# Altium schematic sheet MOTOR_CONTROL-1.SchDoc
size A; SheetNumber: 11; SheetTotal: 12
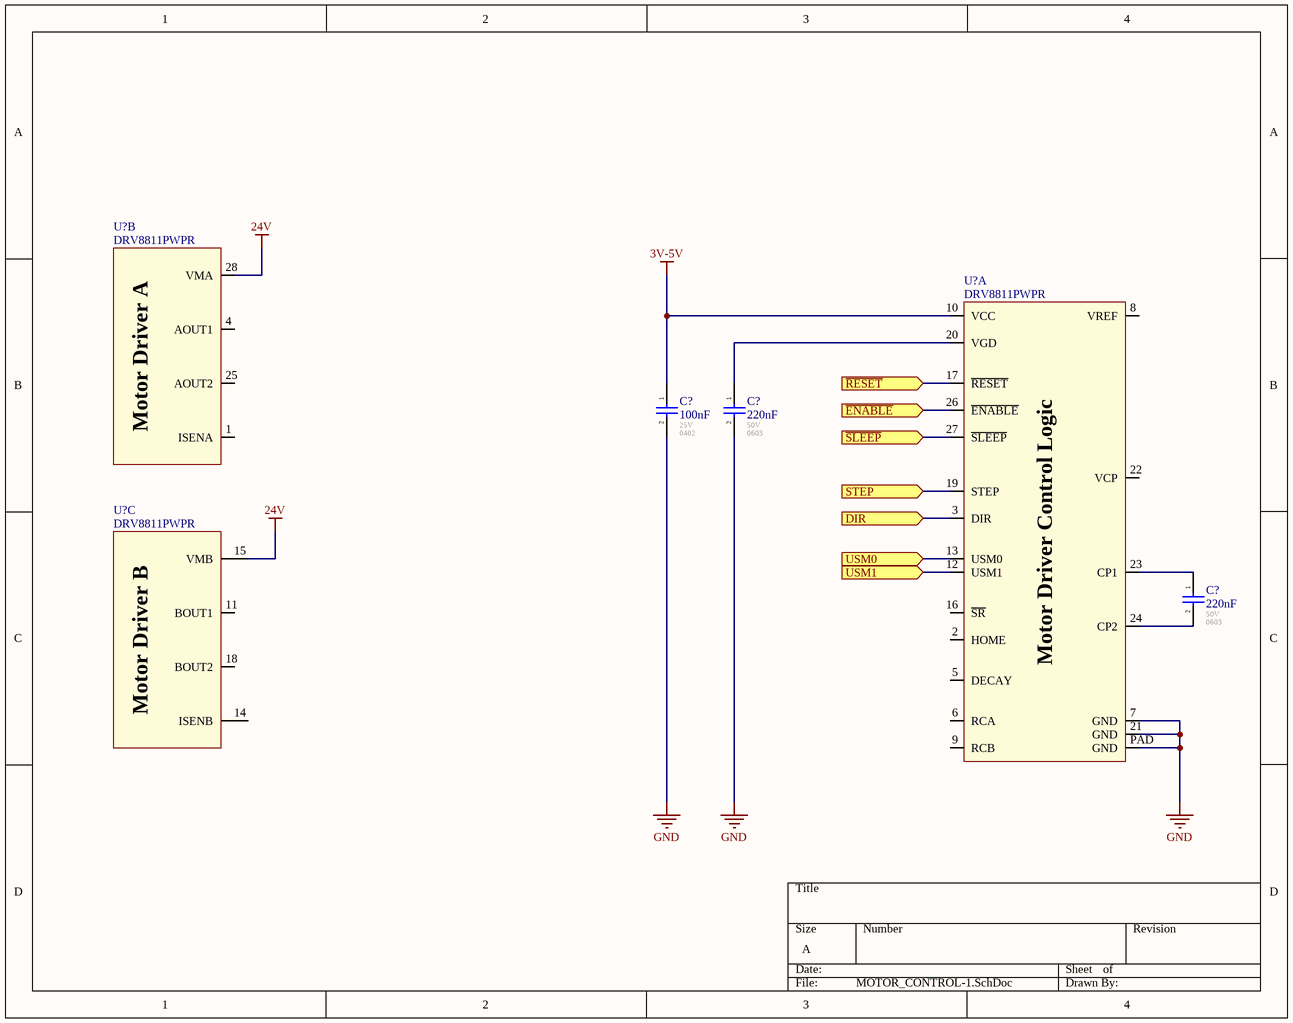
[diagram p0: MOTOR_CONTROL-1.SchDoc]

## Parts
(Parts that share a designator on the sheet are numbered #1, #2 ... from top to bottom, then left to right.)
C?#1  100nF  Voltage - Rated: 25V  Footprint: 0402  [CAP_0402]
C?#2  220nF  Voltage - Rated: 50V  Footprint: 0603  [CAP_0603]
C?#3  220nF  Voltage - Rated: 50V  Footprint: 0603  [CAP_0603]
U?#1  DRV8811PWPR  [POW_MOTOR_DRV8811PWPR]  (part B of 3)
U?#2  DRV8811PWPR  [POW_MOTOR_DRV8811PWPR]  (part A of 3)
U?#3  DRV8811PWPR  [POW_MOTOR_DRV8811PWPR]  (part C of 3)

## Ports
DIR (in), STEP (in), USM0 (in), USM1 (in), ~{ENABLE} (in), ~{RESET} (in), ~{SLEEP} (in)

## Nets
3V-5V: C?#1.1 U?#2.10(VCC)
24V: U?#1.28(VMA) U?#3.15(VMB)
GND: C?#1.2 C?#2.2 U?#2.7(GND) U?#2.21(GND) U?#2.PAD(GND)
~{ENABLE}: U?#2.26(~{ENABLE}) ; port ~{ENABLE}
~{RESET}: U?#2.17(~{RESET}) ; port ~{RESET}
~{SLEEP}: U?#2.27(~{SLEEP}) ; port ~{SLEEP}
DIR: U?#2.3(DIR) ; port DIR
STEP: U?#2.19(STEP) ; port STEP
USM0: U?#2.13(USM0) ; port USM0
USM1: U?#2.12(USM1) ; port USM1
NetC?#2_1: C?#2.1 U?#2.20(VGD)
NetC?#3_1: C?#3.1 U?#2.23(CP1)
NetC?#3_2: C?#3.2 U?#2.24(CP2)

Not connected (* = marked no-connect by the designer): U?#1 1(ISENA) 4(AOUT1) 25(AOUT2); U?#2 2(HOME) 5(DECAY) 6(RCA) 8(VREF) 9(RCB) 16(~{SR}) 22(VCP); U?#3 11(BOUT1) 14(ISENB) 18(BOUT2)

## Notes on the sheet
- (in symbol POW_MOTOR_DRV8811PWPR, part A) Motor Driver Control Logic
- (in symbol POW_MOTOR_DRV8811PWPR, part B) Motor Driver A
- (in symbol POW_MOTOR_DRV8811PWPR, part C) Motor Driver B

## Library data of the parts
C?#1 = CAP_CER: 0402 100nF X7R Ceramic Capacitor; Operating Temperature: *; Tolerance: X7R; Mfr: *; ComponentLink1Description: Digikey; ComponentLink1URL: [Digikey Link]; Digikey Part No: *; ComponentLink2Description: Datasheet; ComponentLink2URL: [Datasheet Link]
C?#2 C?#3 = CAP_CER: 0603 220nF X7R Ceramic Capacitor; Operating Temperature: *; Tolerance: X7R; Mfr: *; ComponentLink1Description: Digikey; ComponentLink1URL: [Digikey Link]; Digikey Part No: *; ComponentLink2Description: Datasheet; ComponentLink2URL: [Datasheet Link]
U?#1-U?#3 = POW_MOTOR_DRV8811PWPR: POW - STEPPER MOTOR DRIVER - SOP-28; Voltage: 3 V ~ 5.5 V / 8 V ~ 38 V; Mfg: Texas Instrument; Current: *; Power: *; Mfg Part Number: DRV8811PWPR; HelpURL: http://www.ti.com/lit/ds/symlink/drv8811.pdf; CreatedBy: Jonathan Bouchard; Temperature: -40°C ~ 150°C (TJ); Value: *; Precision: *; Package: SOP-28; Supplier 1: Digikey; Supplier Part Number 1: 296-24591-1-ND